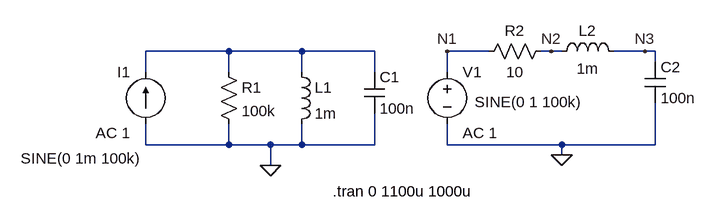
[diagram p0: schematic RLC Circuits' Simulation.asc]
RLC Circuits' Simulation.asc, the LTspice schematic file:
Version 4
SHEET 1 880 680
WIRE 48 64 -80 64
WIRE 160 64 48 64
WIRE 272 64 160 64
WIRE 448 64 384 64
WIRE 544 64 528 64
WIRE 560 64 544 64
WIRE 688 64 640 64
WIRE 704 64 688 64
WIRE 704 80 704 64
WIRE -80 96 -80 64
WIRE 48 96 48 64
WIRE 160 96 160 64
WIRE 272 96 272 64
WIRE 384 96 384 64
WIRE -80 208 -80 176
WIRE 48 208 48 176
WIRE 48 208 -80 208
WIRE 112 208 48 208
WIRE 160 208 160 176
WIRE 160 208 112 208
WIRE 272 208 272 160
WIRE 272 208 160 208
WIRE 384 208 384 176
WIRE 560 208 384 208
WIRE 704 208 704 144
WIRE 704 208 560 208
WIRE 560 224 560 208
WIRE 112 240 112 208
FLAG 112 240 0
FLAG 560 224 0
FLAG 384 64 N1
FLAG 544 64 N2
FLAG 688 64 N3
SYMBOL res 32 80 R0
SYMATTR InstName R1
SYMATTR Value 100k
SYMBOL ind 144 80 R0
SYMATTR InstName L1
SYMATTR Value 1m
SYMBOL cap 256 96 R0
SYMATTR InstName C1
SYMATTR Value 100n
SYMBOL current -80 176 R180
WINDOW 0 24 80 Left 2
WINDOW 3 7 -53 Left 2
WINDOW 123 24 -14 Left 2
WINDOW 39 0 0 Left 2
SYMATTR InstName I1
SYMATTR Value SINE(0 1m 100k)
SYMATTR Value2 AC 1
SYMBOL voltage 384 80 R0
WINDOW 3 42 62 Left 2
WINDOW 123 24 110 Left 2
WINDOW 39 0 0 Left 2
SYMATTR Value SINE(0 1 100k)
SYMATTR Value2 AC 1
SYMATTR InstName V1
SYMBOL res 544 48 R90
WINDOW 0 0 56 VBottom 2
WINDOW 3 32 56 VTop 2
SYMATTR InstName R2
SYMATTR Value 10
SYMBOL ind 544 80 R270
WINDOW 0 32 56 VTop 2
WINDOW 3 5 56 VBottom 2
SYMATTR InstName L2
SYMATTR Value 1m
SYMBOL cap 688 80 R0
SYMATTR InstName C2
SYMATTR Value 100n
TEXT 208 280 Left 2 !.tran 0 1100u 1000u

The netlist it stands for:
* RLC Circuits' Simulation.asc
R1 N001 0 100k
L1 N001 0 1m
C1 N001 0 100n
I1 0 N001 SINE(0 1m 100k) AC 1
V1 N1 0 SINE(0 1 100k) AC 1
R2 N2 N1 10
L2 N2 N3 1m
C2 N3 0 100n
.tran 0 1100u 1000u
.backanno
.end